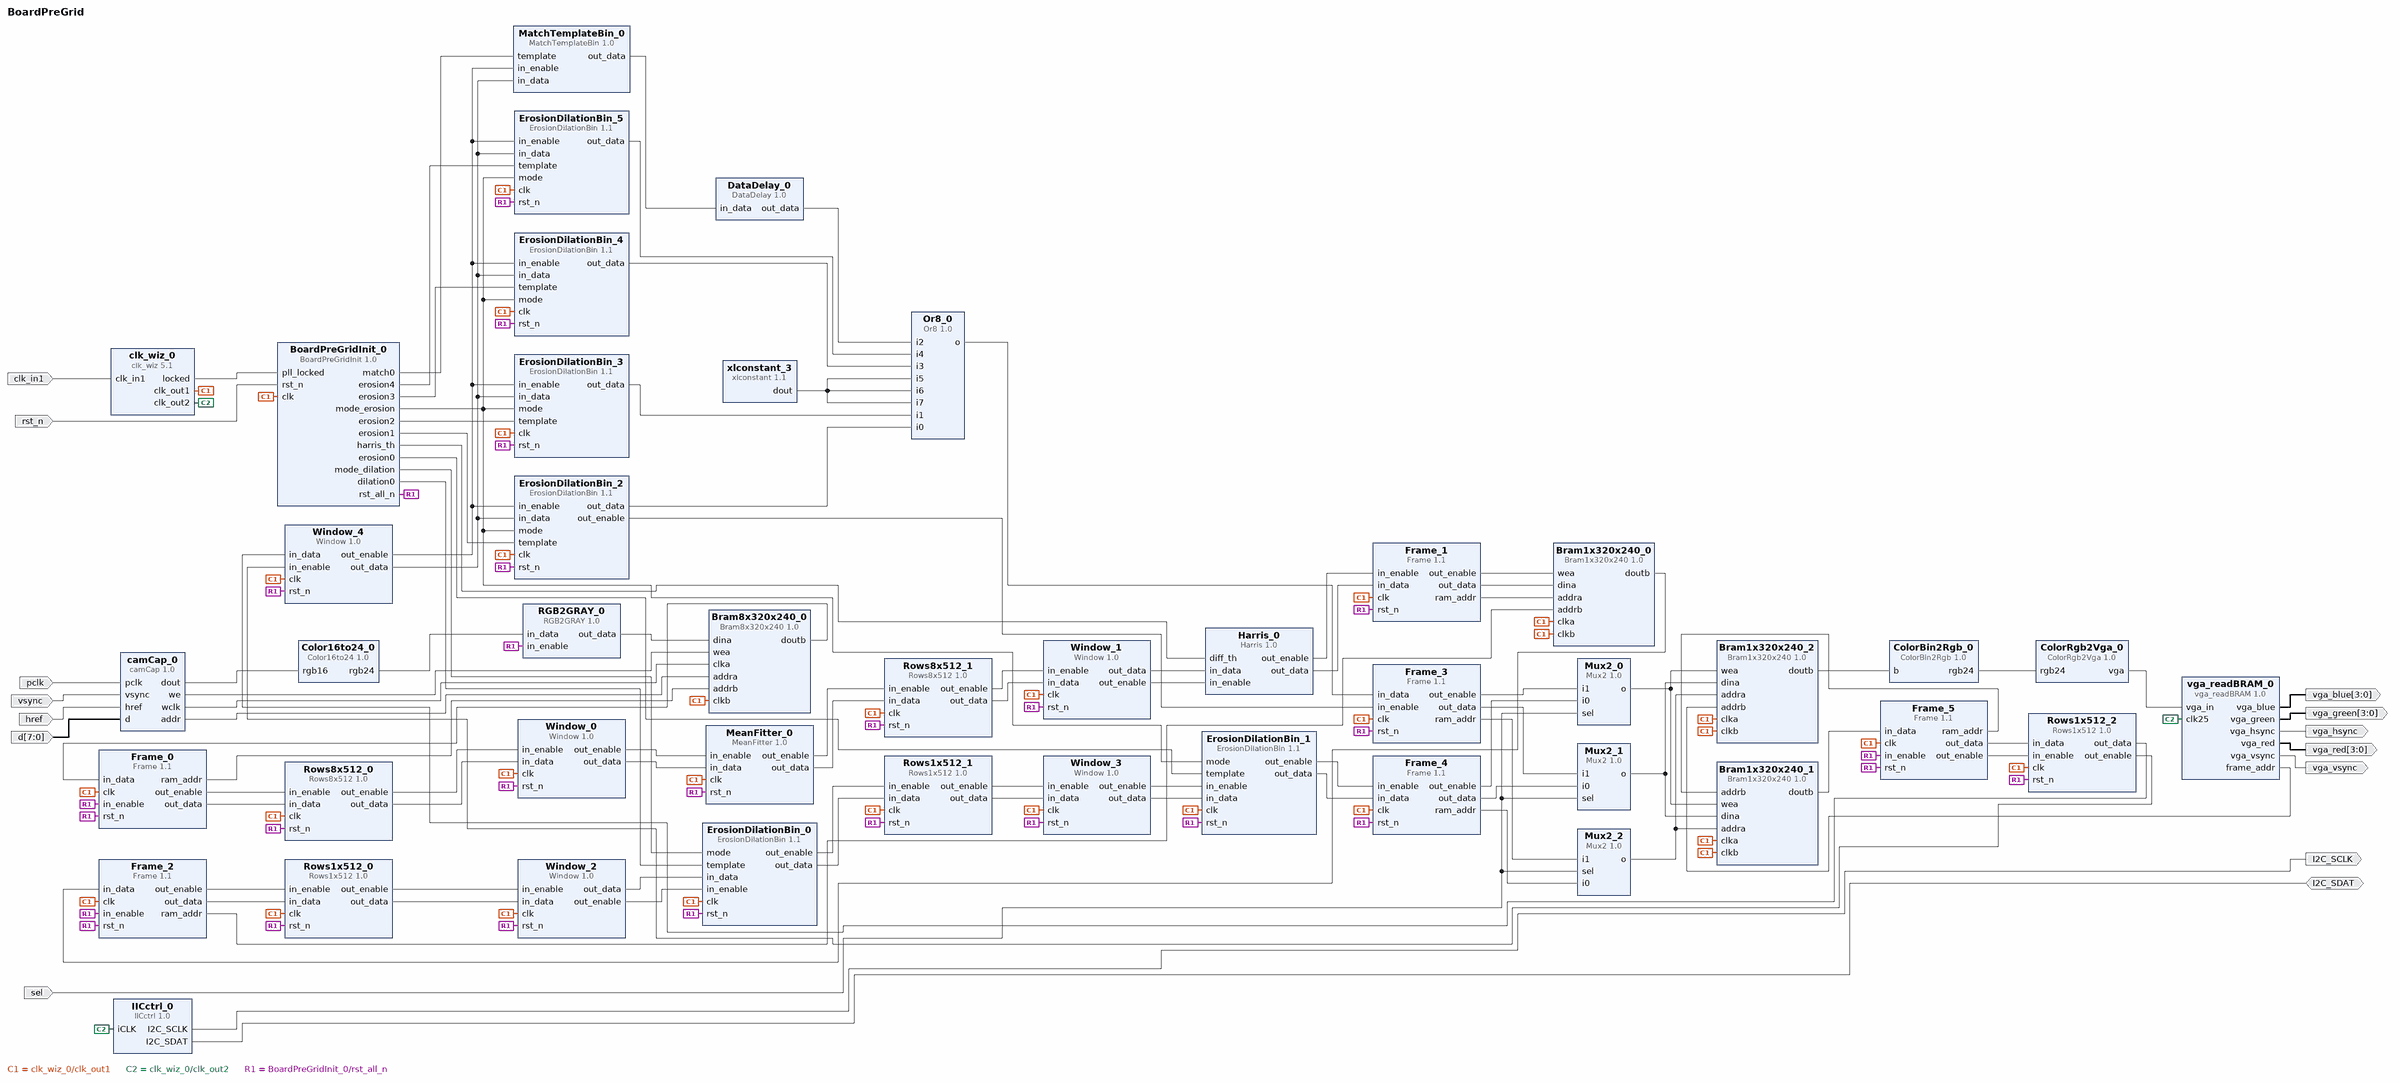
[diagram p0: block diagram of the top level]
# Vivado block design BoardPreGrid, Vivado 2014.4
create_bd_design BoardPreGrid

create_bd_port -dir I sel
create_bd_port -dir O I2C_SCLK
create_bd_port -dir IO I2C_SDAT
create_bd_port -dir I pclk
create_bd_port -dir I vsync
create_bd_port -dir I href
create_bd_port -dir I -from 7 -to 0 d
create_bd_port -dir I -type clk clk_in1
create_bd_port -dir I rst_n
create_bd_port -dir O -from 3 -to 0 vga_red
create_bd_port -dir O -from 3 -to 0 vga_green
create_bd_port -dir O -from 3 -to 0 vga_blue
create_bd_port -dir O vga_hsync
create_bd_port -dir O vga_vsync

create_bd_cell -type ip -vlnv xilinx.com:XUP:camCap:1.0 camCap_0
create_bd_cell -type ip -vlnv dtysky:Image:Color16to24:1.0 Color16to24_0
create_bd_cell -type ip -vlnv dtysky:Image:RGB2GRAY:1.0 RGB2GRAY_0
create_bd_cell -type ip -vlnv dtysky:Image:Rows8x512:1.0 Rows8x512_0
set_property -dict {CONFIG.rows_width 3} [get_bd_cells Rows8x512_0]
create_bd_cell -type ip -vlnv dtysky:Image:Window:1.0 Window_0
create_bd_cell -type ip -vlnv dtysky:Image:Frame:1.1 Frame_0
set_property -dict {CONFIG.mode 1} [get_bd_cells Frame_0]
create_bd_cell -type ip -vlnv dtysky:Image:Frame:1.1 Frame_1
set_property -dict {CONFIG.color_width 1 CONFIG.row_init 1} [get_bd_cells Frame_1]
create_bd_cell -type ip -vlnv dtysky:Image:Rows8x512:1.0 Rows8x512_1
set_property -dict {CONFIG.rows_width 3} [get_bd_cells Rows8x512_1]
create_bd_cell -type ip -vlnv dtysky:Image:Window:1.0 Window_1
create_bd_cell -type ip -vlnv dtysky:Image:Harris:1.0 Harris_0
create_bd_cell -type ip -vlnv xilinx.com:ip:Bram8x320x240:1.0 Bram8x320x240_0
create_bd_cell -type ip -vlnv xilinx.com:ip:Bram1x320x240:1.0 Bram1x320x240_0
create_bd_cell -type ip -vlnv dtysky:Image:Rows1x512:1.0 Rows1x512_0
set_property -dict {CONFIG.rows_width 3} [get_bd_cells Rows1x512_0]
create_bd_cell -type ip -vlnv dtysky:Image:Window:1.0 Window_2
set_property -dict {CONFIG.color_width 1 CONFIG.window_size 3} [get_bd_cells Window_2]
create_bd_cell -type ip -vlnv dtysky:Image:Frame:1.1 Frame_2
set_property -dict {CONFIG.mode 1 CONFIG.color_width 1} [get_bd_cells Frame_2]
create_bd_cell -type ip -vlnv dtysky:Image:ErosionDilationBin:1.1 ErosionDilationBin_0
set_property -dict {CONFIG.window_size 3 CONFIG.pip_counter 3} [get_bd_cells ErosionDilationBin_0]
create_bd_cell -type ip -vlnv dtysky:Image:MeanFitter:1.0 MeanFitter_0
set_property -dict {CONFIG.window_size 3} [get_bd_cells MeanFitter_0]
create_bd_cell -type ip -vlnv dtysky:Image:Rows1x512:1.0 Rows1x512_1
set_property -dict {CONFIG.rows_width 5} [get_bd_cells Rows1x512_1]
create_bd_cell -type ip -vlnv dtysky:Image:Window:1.0 Window_3
set_property -dict {CONFIG.color_width 1 CONFIG.window_size 5} [get_bd_cells Window_3]
create_bd_cell -type ip -vlnv dtysky:Image:ErosionDilationBin:1.1 ErosionDilationBin_1
create_bd_cell -type ip -vlnv dtysky:Image:Frame:1.1 Frame_3
set_property -dict {CONFIG.color_width 1 CONFIG.row_init 1} [get_bd_cells Frame_3]
create_bd_cell -type ip -vlnv dtysky:Image:Frame:1.1 Frame_4
set_property -dict {CONFIG.color_width 1 CONFIG.row_init 2} [get_bd_cells Frame_4]
create_bd_cell -type ip -vlnv xilinx.com:ip:Bram1x320x240:1.0 Bram1x320x240_1
create_bd_cell -type ip -vlnv dtysky:Image:Frame:1.1 Frame_5
set_property -dict {CONFIG.mode 1 CONFIG.color_width 1} [get_bd_cells Frame_5]
create_bd_cell -type ip -vlnv dtysky:Image:Rows1x512:1.0 Rows1x512_2
set_property -dict {CONFIG.rows_width 3} [get_bd_cells Rows1x512_2]
create_bd_cell -type ip -vlnv dtysky:Image:Window:1.0 Window_4
set_property -dict {CONFIG.color_width 1} [get_bd_cells Window_4]
create_bd_cell -type ip -vlnv dtysky:Image:ErosionDilationBin:1.1 ErosionDilationBin_2
set_property -dict {CONFIG.window_size 3 CONFIG.pip_counter 3} [get_bd_cells ErosionDilationBin_2]
create_bd_cell -type ip -vlnv dtysky:Image:ErosionDilationBin:1.1 ErosionDilationBin_3
set_property -dict {CONFIG.window_size 3 CONFIG.pip_counter 3} [get_bd_cells ErosionDilationBin_3]
create_bd_cell -type ip -vlnv dtysky:Image:ErosionDilationBin:1.1 ErosionDilationBin_4
set_property -dict {CONFIG.window_size 3 CONFIG.pip_counter 3} [get_bd_cells ErosionDilationBin_4]
create_bd_cell -type ip -vlnv dtysky:Image:ErosionDilationBin:1.1 ErosionDilationBin_5
set_property -dict {CONFIG.window_size 3 CONFIG.pip_counter 3} [get_bd_cells ErosionDilationBin_5]
create_bd_cell -type ip -vlnv dtysky:Image:MatchTemplateBin:1.0 MatchTemplateBin_0
create_bd_cell -type ip -vlnv xilinx.com:ip:xlconstant:1.1 xlconstant_3
set_property -dict {CONFIG.CONST_VAL 0} [get_bd_cells xlconstant_3]
create_bd_cell -type ip -vlnv dtysky:user:Or8:1.0 Or8_0
create_bd_cell -type ip -vlnv xilinx.com:ip:Bram1x320x240:1.0 Bram1x320x240_2
create_bd_cell -type ip -vlnv dtysky:Image:ColorBin2Rgb:1.0 ColorBin2Rgb_0
create_bd_cell -type ip -vlnv dtysky:Image:ColorRgb2Vga:1.0 ColorRgb2Vga_0
create_bd_cell -type ip -vlnv xilinx.com:user:vga_readBRAM:1.0 vga_readBRAM_0
create_bd_cell -type ip -vlnv dtysky:user:Mux2:1.0 Mux2_0
set_property -dict {CONFIG.data_width 1} [get_bd_cells Mux2_0]
create_bd_cell -type ip -vlnv dtysky:user:Mux2:1.0 Mux2_1
set_property -dict {CONFIG.data_width 1} [get_bd_cells Mux2_1]
create_bd_cell -type ip -vlnv dtysky:user:Mux2:1.0 Mux2_2
set_property -dict {CONFIG.data_width 17} [get_bd_cells Mux2_2]
create_bd_cell -type ip -vlnv dtysky:Image:DataDelay:1.0 DataDelay_0
create_bd_cell -type ip -vlnv xilinx.com:ip:clk_wiz:5.1 clk_wiz_0
set_property -dict [list \
  CONFIG.CLKOUT2_USED true \
  CONFIG.CLKOUT3_USED false \
  CONFIG.NUM_OUT_CLKS 2 \
  CONFIG.CLKOUT1_REQUESTED_OUT_FREQ 100 \
  CONFIG.CLKOUT2_REQUESTED_OUT_FREQ 25 \
  CONFIG.USE_RESET false \
  CONFIG.CLKOUT1_JITTER 130.958 \
  CONFIG.CLKOUT1_PHASE_ERROR 98.575 \
  CONFIG.CLKOUT2_JITTER 175.402 \
  CONFIG.CLKOUT2_PHASE_ERROR 98.575 \
  CONFIG.CLKOUT3_JITTER 130.958 \
  CONFIG.CLKOUT3_PHASE_ERROR 98.575 \
] [get_bd_cells clk_wiz_0]
create_bd_cell -type ip -vlnv xilinx.com:XUP:IICctrl:1.0 IICctrl_0
create_bd_cell -type ip -vlnv dtysky:Image:BoardPreGridInit:1.0 BoardPreGridInit_0

# ---- connections ----

connect_bd_net [get_bd_pins camCap_0/dout] [get_bd_pins Color16to24_0/rgb16]
connect_bd_net [get_bd_pins Color16to24_0/rgb24] [get_bd_pins RGB2GRAY_0/in_data]
connect_bd_net [get_bd_pins Rows8x512_0/out_enable] [get_bd_pins Window_0/in_enable]
connect_bd_net [get_bd_pins Rows8x512_0/out_data] [get_bd_pins Window_0/in_data]
connect_bd_net [get_bd_pins Window_0/out_enable] [get_bd_pins MeanFitter_0/in_enable]
connect_bd_net [get_bd_pins Window_0/out_data] [get_bd_pins MeanFitter_0/in_data]
connect_bd_net [get_bd_pins Frame_0/out_enable] [get_bd_pins Rows8x512_0/in_enable]
connect_bd_net [get_bd_pins Frame_0/out_data] [get_bd_pins Rows8x512_0/in_data]
connect_bd_net [get_bd_pins MeanFitter_0/out_enable] [get_bd_pins Rows8x512_1/in_enable]
connect_bd_net [get_bd_pins MeanFitter_0/out_data] [get_bd_pins Rows8x512_1/in_data]
connect_bd_net [get_bd_pins Rows8x512_1/out_enable] [get_bd_pins Window_1/in_enable]
connect_bd_net [get_bd_pins Rows8x512_1/out_data] [get_bd_pins Window_1/in_data]
connect_bd_net [get_bd_pins Window_1/out_data] [get_bd_pins Harris_0/in_data]
connect_bd_net [get_bd_pins Window_1/out_enable] [get_bd_pins Harris_0/in_enable]
connect_bd_net [get_bd_pins Harris_0/out_enable] [get_bd_pins Frame_1/in_enable]
connect_bd_net [get_bd_pins Harris_0/out_data] [get_bd_pins Frame_1/in_data]
connect_bd_net [get_bd_pins camCap_0/we] [get_bd_pins Bram8x320x240_0/wea]
connect_bd_net [get_bd_pins camCap_0/wclk] [get_bd_pins Bram8x320x240_0/clka]
connect_bd_net [get_bd_pins RGB2GRAY_0/out_data] [get_bd_pins Bram8x320x240_0/dina]
connect_bd_net [get_bd_pins camCap_0/addr] [get_bd_pins Bram8x320x240_0/addra]
connect_bd_net [get_bd_pins Bram8x320x240_0/doutb] [get_bd_pins Frame_0/in_data]
connect_bd_net [get_bd_pins Frame_0/ram_addr] [get_bd_pins Bram8x320x240_0/addrb]
connect_bd_net [get_bd_pins Frame_1/out_enable] [get_bd_pins Bram1x320x240_0/wea]
connect_bd_net [get_bd_pins Frame_1/out_data] [get_bd_pins Bram1x320x240_0/dina]
connect_bd_net [get_bd_pins Frame_1/ram_addr] [get_bd_pins Bram1x320x240_0/addra]
connect_bd_net [get_bd_pins Rows1x512_0/out_enable] [get_bd_pins Window_2/in_enable]
connect_bd_net [get_bd_pins Rows1x512_0/out_data] [get_bd_pins Window_2/in_data]
connect_bd_net [get_bd_pins Frame_2/out_enable] [get_bd_pins Rows1x512_0/in_enable]
connect_bd_net [get_bd_pins Frame_2/out_data] [get_bd_pins Rows1x512_0/in_data]
connect_bd_net [get_bd_pins Frame_2/ram_addr] [get_bd_pins Bram1x320x240_0/addrb]
connect_bd_net [get_bd_pins Bram1x320x240_0/doutb] [get_bd_pins Frame_2/in_data]
connect_bd_net [get_bd_pins Window_2/out_data] [get_bd_pins ErosionDilationBin_0/in_data]
connect_bd_net [get_bd_pins Window_2/out_enable] [get_bd_pins ErosionDilationBin_0/in_enable]
connect_bd_net [get_bd_pins ErosionDilationBin_0/out_enable] [get_bd_pins Rows1x512_1/in_enable]
connect_bd_net [get_bd_pins ErosionDilationBin_0/out_data] [get_bd_pins Rows1x512_1/in_data]
connect_bd_net [get_bd_pins Rows1x512_1/out_enable] [get_bd_pins Window_3/in_enable]
connect_bd_net [get_bd_pins Rows1x512_1/out_data] [get_bd_pins Window_3/in_data]
connect_bd_net [get_bd_pins Window_3/out_enable] [get_bd_pins ErosionDilationBin_1/in_enable]
connect_bd_net [get_bd_pins Window_3/out_data] [get_bd_pins ErosionDilationBin_1/in_data]
connect_bd_net [get_bd_pins Bram1x320x240_1/doutb] [get_bd_pins Frame_5/in_data]
connect_bd_net [get_bd_pins Frame_5/ram_addr] [get_bd_pins Bram1x320x240_1/addrb]
connect_bd_net [get_bd_pins Frame_5/out_data] [get_bd_pins Rows1x512_2/in_data]
connect_bd_net [get_bd_pins Frame_5/out_enable] [get_bd_pins Rows1x512_2/in_enable]
connect_bd_net [get_bd_pins Rows1x512_2/out_data] [get_bd_pins Window_4/in_data]
connect_bd_net [get_bd_pins Rows1x512_2/out_enable] [get_bd_pins Window_4/in_enable]
connect_bd_net [get_bd_pins Window_4/out_enable] \
  [get_bd_pins ErosionDilationBin_3/in_enable] [get_bd_pins MatchTemplateBin_0/in_enable] \
  [get_bd_pins ErosionDilationBin_4/in_enable] [get_bd_pins ErosionDilationBin_5/in_enable] \
  [get_bd_pins ErosionDilationBin_2/in_enable]
connect_bd_net [get_bd_pins Window_4/out_data] \
  [get_bd_pins ErosionDilationBin_3/in_data] [get_bd_pins MatchTemplateBin_0/in_data] \
  [get_bd_pins ErosionDilationBin_4/in_data] [get_bd_pins ErosionDilationBin_5/in_data] \
  [get_bd_pins ErosionDilationBin_2/in_data]
connect_bd_net [get_bd_pins xlconstant_3/dout] [get_bd_pins Or8_0/i5] [get_bd_pins Or8_0/i6] [get_bd_pins Or8_0/i7]
connect_bd_net [get_bd_pins ErosionDilationBin_2/out_data] [get_bd_pins Or8_0/i0]
connect_bd_net [get_bd_pins ErosionDilationBin_3/out_data] [get_bd_pins Or8_0/i1]
connect_bd_net [get_bd_pins ErosionDilationBin_4/out_data] [get_bd_pins Or8_0/i3]
connect_bd_net [get_bd_pins ErosionDilationBin_5/out_data] [get_bd_pins Or8_0/i4]
connect_bd_net [get_bd_pins Or8_0/o] [get_bd_pins Frame_3/in_data]
connect_bd_net [get_bd_pins ErosionDilationBin_2/out_enable] [get_bd_pins Frame_3/in_enable]
connect_bd_net [get_bd_pins Bram1x320x240_2/doutb] [get_bd_pins ColorBin2Rgb_0/b]
connect_bd_net [get_bd_pins ColorBin2Rgb_0/rgb24] [get_bd_pins ColorRgb2Vga_0/rgb24]
connect_bd_net [get_bd_pins ColorRgb2Vga_0/vga] [get_bd_pins vga_readBRAM_0/vga_in]
connect_bd_net [get_bd_pins vga_readBRAM_0/frame_addr] [get_bd_pins Bram1x320x240_2/addrb]
connect_bd_net [get_bd_pins ErosionDilationBin_1/out_enable] [get_bd_pins Frame_4/in_enable]
connect_bd_net [get_bd_pins ErosionDilationBin_1/out_data] [get_bd_pins Frame_4/in_data]
connect_bd_net [get_bd_pins Frame_4/out_enable] [get_bd_pins Mux2_0/i0]
connect_bd_net [get_bd_pins Frame_4/out_data] [get_bd_pins Mux2_1/i0]
connect_bd_net [get_bd_pins Frame_4/ram_addr] [get_bd_pins Mux2_2/i0]
connect_bd_net [get_bd_pins Frame_3/out_enable] [get_bd_pins Mux2_0/i1]
connect_bd_net [get_bd_pins Frame_3/out_data] [get_bd_pins Mux2_1/i1]
connect_bd_net [get_bd_pins Frame_3/ram_addr] [get_bd_pins Mux2_2/i1]
connect_bd_net [get_bd_pins Mux2_0/o] [get_bd_pins Bram1x320x240_1/wea] [get_bd_pins Bram1x320x240_2/wea]
connect_bd_net [get_bd_pins Mux2_1/o] [get_bd_pins Bram1x320x240_1/dina] [get_bd_pins Bram1x320x240_2/dina]
connect_bd_net [get_bd_pins Mux2_2/o] [get_bd_pins Bram1x320x240_1/addra] [get_bd_pins Bram1x320x240_2/addra]
connect_bd_net [get_bd_pins MatchTemplateBin_0/out_data] [get_bd_pins DataDelay_0/in_data]
connect_bd_net [get_bd_pins DataDelay_0/out_data] [get_bd_pins Or8_0/i2]
connect_bd_net [get_bd_pins clk_wiz_0/clk_out1] \
  [get_bd_pins Bram1x320x240_0/clka] [get_bd_pins Bram1x320x240_0/clkb] [get_bd_pins Bram1x320x240_1/clka] \
  [get_bd_pins Bram1x320x240_1/clkb] [get_bd_pins Bram1x320x240_2/clka] [get_bd_pins Bram1x320x240_2/clkb] \
  [get_bd_pins Bram8x320x240_0/clkb] [get_bd_pins ErosionDilationBin_0/clk] [get_bd_pins ErosionDilationBin_1/clk] \
  [get_bd_pins ErosionDilationBin_2/clk] [get_bd_pins ErosionDilationBin_3/clk] [get_bd_pins ErosionDilationBin_4/clk] \
  [get_bd_pins Frame_0/clk] [get_bd_pins Frame_1/clk] [get_bd_pins Frame_2/clk] [get_bd_pins Frame_3/clk] \
  [get_bd_pins Frame_4/clk] [get_bd_pins Frame_5/clk] [get_bd_pins MeanFitter_0/clk] [get_bd_pins Rows1x512_0/clk] \
  [get_bd_pins Rows1x512_1/clk] [get_bd_pins Rows1x512_2/clk] [get_bd_pins Rows8x512_0/clk] [get_bd_pins Rows8x512_1/clk] \
  [get_bd_pins Window_0/clk] [get_bd_pins Window_1/clk] [get_bd_pins Window_2/clk] [get_bd_pins Window_3/clk] \
  [get_bd_pins Window_4/clk] [get_bd_pins ErosionDilationBin_5/clk] [get_bd_pins BoardPreGridInit_0/clk]
connect_bd_net [get_bd_pins clk_wiz_0/clk_out2] [get_bd_pins vga_readBRAM_0/clk25] [get_bd_pins IICctrl_0/iCLK]
connect_bd_net [get_bd_pins clk_wiz_0/locked] [get_bd_pins BoardPreGridInit_0/pll_locked]
connect_bd_net [get_bd_pins BoardPreGridInit_0/rst_all_n] \
  [get_bd_pins ErosionDilationBin_0/rst_n] [get_bd_pins ErosionDilationBin_1/rst_n] [get_bd_pins ErosionDilationBin_2/rst_n] \
  [get_bd_pins ErosionDilationBin_3/rst_n] [get_bd_pins ErosionDilationBin_4/rst_n] [get_bd_pins ErosionDilationBin_5/rst_n] \
  [get_bd_pins Frame_0/rst_n] [get_bd_pins Frame_1/rst_n] [get_bd_pins Frame_2/rst_n] [get_bd_pins Frame_3/rst_n] \
  [get_bd_pins Frame_4/rst_n] [get_bd_pins Frame_5/rst_n] [get_bd_pins MeanFitter_0/rst_n] [get_bd_pins Rows1x512_0/rst_n] \
  [get_bd_pins Rows1x512_1/rst_n] [get_bd_pins Rows1x512_2/rst_n] [get_bd_pins Rows8x512_0/rst_n] \
  [get_bd_pins Rows8x512_1/rst_n] [get_bd_pins Window_0/rst_n] [get_bd_pins Window_1/rst_n] [get_bd_pins Window_3/rst_n] \
  [get_bd_pins Window_4/rst_n] [get_bd_pins Window_2/rst_n] [get_bd_pins Frame_2/in_enable] [get_bd_pins Frame_0/in_enable] \
  [get_bd_pins Frame_5/in_enable] [get_bd_pins RGB2GRAY_0/in_enable]
connect_bd_net [get_bd_pins BoardPreGridInit_0/mode_dilation] [get_bd_pins ErosionDilationBin_0/mode]
connect_bd_net [get_bd_pins BoardPreGridInit_0/mode_erosion] \
  [get_bd_pins ErosionDilationBin_1/mode] [get_bd_pins ErosionDilationBin_2/mode] [get_bd_pins ErosionDilationBin_3/mode] \
  [get_bd_pins ErosionDilationBin_4/mode] [get_bd_pins ErosionDilationBin_5/mode]
connect_bd_net [get_bd_pins BoardPreGridInit_0/dilation0] [get_bd_pins ErosionDilationBin_0/template]
connect_bd_net [get_bd_pins BoardPreGridInit_0/erosion0] [get_bd_pins ErosionDilationBin_1/template]
connect_bd_net [get_bd_pins BoardPreGridInit_0/erosion1] [get_bd_pins ErosionDilationBin_2/template]
connect_bd_net [get_bd_pins BoardPreGridInit_0/erosion2] [get_bd_pins ErosionDilationBin_3/template]
connect_bd_net [get_bd_pins BoardPreGridInit_0/erosion3] [get_bd_pins ErosionDilationBin_4/template]
connect_bd_net [get_bd_pins BoardPreGridInit_0/erosion4] [get_bd_pins ErosionDilationBin_5/template]
connect_bd_net [get_bd_pins BoardPreGridInit_0/match0] [get_bd_pins MatchTemplateBin_0/template]
connect_bd_net [get_bd_pins BoardPreGridInit_0/harris_th] [get_bd_pins Harris_0/diff_th]
connect_bd_net [get_bd_ports sel] [get_bd_pins Mux2_0/sel] [get_bd_pins Mux2_1/sel] [get_bd_pins Mux2_2/sel]
connect_bd_net [get_bd_pins IICctrl_0/I2C_SCLK] [get_bd_ports I2C_SCLK]
connect_bd_net [get_bd_pins IICctrl_0/I2C_SDAT] [get_bd_ports I2C_SDAT]
connect_bd_net [get_bd_ports pclk] [get_bd_pins camCap_0/pclk]
connect_bd_net [get_bd_ports vsync] [get_bd_pins camCap_0/vsync]
connect_bd_net [get_bd_ports href] [get_bd_pins camCap_0/href]
connect_bd_net [get_bd_ports d] [get_bd_pins camCap_0/d]
connect_bd_net -net clk_in1_1 [get_bd_ports clk_in1] [get_bd_pins clk_wiz_0/clk_in1]
connect_bd_net [get_bd_ports rst_n] [get_bd_pins BoardPreGridInit_0/rst_n]
connect_bd_net [get_bd_pins vga_readBRAM_0/vga_red] [get_bd_ports vga_red]
connect_bd_net [get_bd_pins vga_readBRAM_0/vga_green] [get_bd_ports vga_green]
connect_bd_net [get_bd_pins vga_readBRAM_0/vga_blue] [get_bd_ports vga_blue]
connect_bd_net [get_bd_pins vga_readBRAM_0/vga_hsync] [get_bd_ports vga_hsync]
connect_bd_net [get_bd_pins vga_readBRAM_0/vga_vsync] [get_bd_ports vga_vsync]

validate_bd_design
save_bd_design
